# Altium schematic sheet PF5a_Filter1A.SchDoc
size A
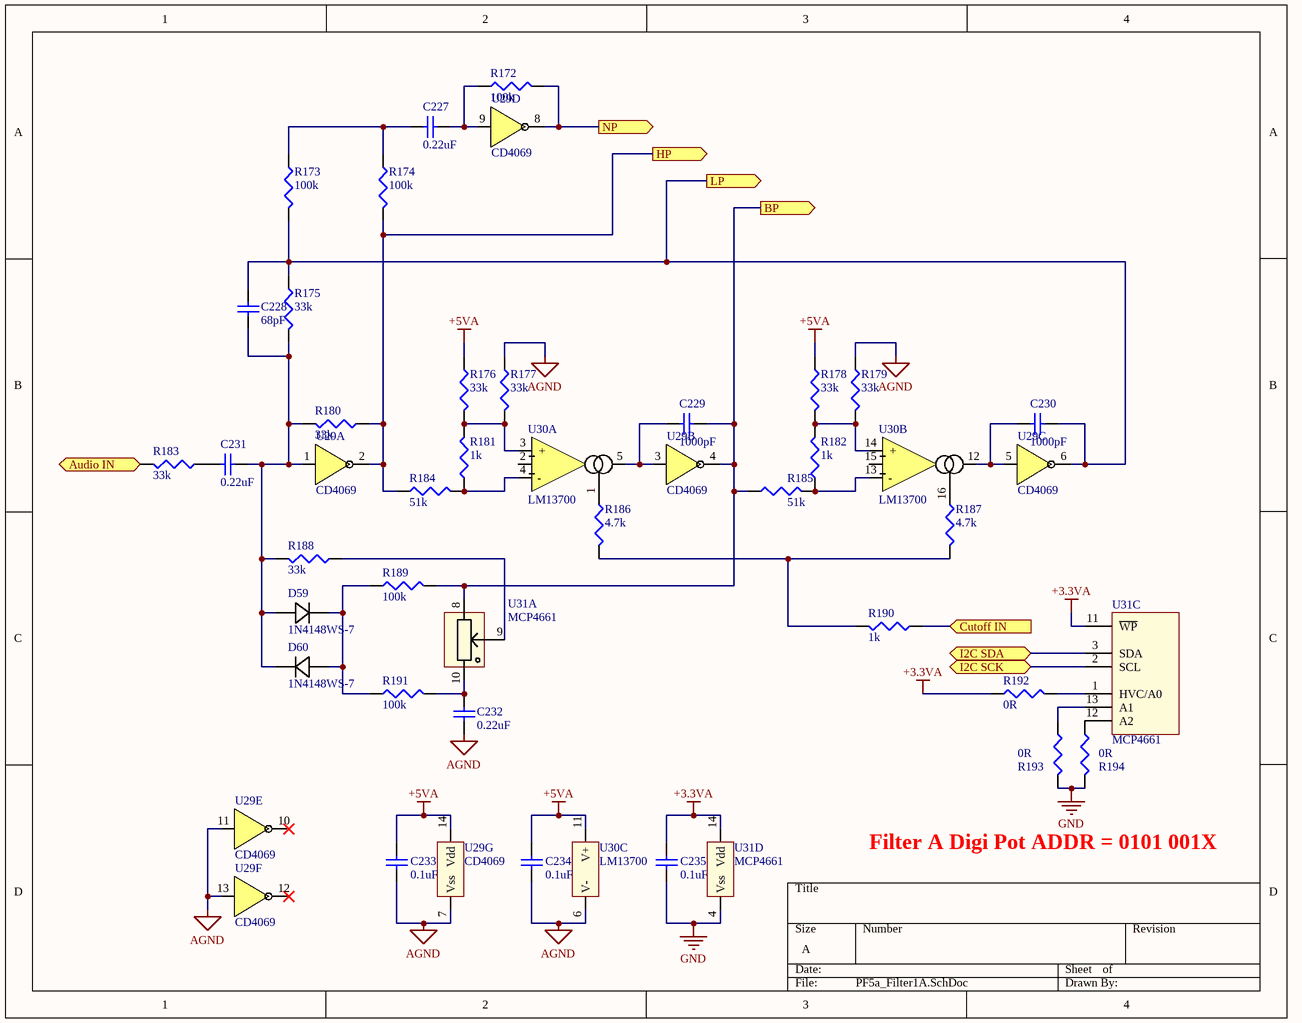
[diagram p0: PF5a_Filter1A.SchDoc]

## Parts
C227  0.22uF  [CAPC1608X08]
C228  68pF  [CAPC1608X08]
C229  1000pF  [CAPC1608X08]
C230  1000pF  [CAPC1608X08]
C231  0.22uF  [CAPC1608X08]
C232  0.22uF  [CAPC1608X08]
C233  0.1uF  [CAPC1608X08]
C234  0.1uF  [CAPC1608X08]
C235  0.1uF  [CAPC1608X08]
D59  1N4148WS-7  [SOD323-M]
D60  1N4148WS-7  [SOD323-M]
R172  100k  [RESC1608X05]
R173  100k  [RESC1608X05]
R174  100k  [RESC1608X05]
R175  33k  [RESC1608X05]
R176  33k  [RESC1608X05]
R177  33k  [RESC1608X05]
R178  33k  [RESC1608X05]
R179  33k  [RESC1608X05]
R180  33k  [RESC1608X05]
R181  1k  [RESC1608X05]
R182  1k  [RESC1608X05]
R183  33k  [RESC1608X05]
R184  51k  [RESC1608X05]
R185  51k  [RESC1608X05]
R186  4.7k  [RESC1608X05]
R187  4.7k  [RESC1608X05]
R188  33k  [RESC1608X05]
R189  100k  [RESC1608X05]
R190  1k  [RESC1608X05]
R191  100k  [RESC1608X05]
R192  0R  [RESC1608X05]
R193  0R  [RESC1608X05]
R194  0R  [RESC1608X05]
U29  CD4069  [D14-M]  (parts A,B,C,D,E,F,G of 7)
U30  LM13700  [SO16NB]  (parts A,B,C of 3)
U31  MCP4661  [TSSOP14_MC-M]  (parts A,C,D of 4)

## Ports
Audio IN (in), BP (out), Cutoff IN (in), HP (out), I2C SCK, I2C SDA, LP (out), NP (out)

## Nets
+3.3VA: C235.1 R192.1 U31.11(~{WP}) U31.14(Vdd)
+5VA: C233.1 C234.1 R176.1 R178.1 U29.14(Vdd) U30.11(V+)
AGND: C232.1 C233.2 C234.2 R177.1 R179.1 U29.7(Vss) U29.11(E) U29.13(F) U30.6(V-)
GND: C235.2 R193.2 R194.2 U31.4(Vss)
Audio IN: R183.2 ; port Audio IN
BP: C229.2 R185.1 R189.2 U29.4(~{B}) U31.8(P0A) ; port BP
Cutoff IN: R190.1 ; port Cutoff IN
HP: R174.2 R180.1 R184.1 U29.2(~{A}) ; port HP
I2C SCK: U31.2(SCL) ; port I2C SCK
I2C SDA: U31.3(SDA) ; port I2C SDA
LP: C228.2 C230.2 R173.2 R175.1 U29.6(~{C}) ; port LP
NP: R172.2 U29.8(~{D}) ; port NP
NetC227_1: C227.1 R173.1 R174.1
NetC227_2: C227.2 R172.1 U29.9(D)
NetC228_1: C228.1 C231.2 D59.2 D60.1 R175.2 R180.2 R188.2 U29.1(A)
NetC229_1: C229.1 U29.3(B) U30.5(OUT)
NetC230_1: C230.1 U29.5(C) U30.12(OUT)
NetC231_1: C231.1 R183.1
NetC232_2: C232.2 R191.2 U31.10(P0B)
NetD59_1: D59.1 D60.2 R189.1 R191.1
NetR176_2: R176.2 R177.2 R181.2 U30.3(+)
NetR178_2: R178.2 R179.2 R182.2 U30.14(+)
NetR181_1: R181.1 R184.2 U30.4(-)
NetR182_1: R182.1 R185.2 U30.13(-)
NetR186_1: R186.1 U30.1(BIAS)
NetR186_2: R186.2 R187.2 R190.2
NetR187_1: R187.1 U30.16(BIAS)
NetR188_1: R188.1 U31.9(P0W)
NetR192_2: R192.2 U31.1(HVC/A0)
NetR193_1: R193.1 U31.13(A1)
NetR194_1: R194.1 U31.12(A2)

Not connected (* = marked no-connect by the designer): U29 10(~{E})* 12(~{F})*; U30 2(Diode_BIAS) 15(Diode_BIAS)

## Notes on the sheet
- Filter A Digi Pot ADDR = 0101 001X

## Library data of the parts
C227 C231 C232 = Cap Semi: Capacitor (Semiconductor SIM Model); Fabricant: MURATA; Fournisseur: Farnell; RefFabricant: GRM188R71A224KA01D; RefFournisseur: 2695909; Value: 0.22uF; Case: 0603 [1608 Metric]; DataSheet: http://www.farnell.com/datasheets/2048635.pdf
C228 = Cap Semi: Capacitor (Semiconductor SIM Model); Fabricant: MURATA; Fournisseur: Farnell; RefFabricant: GRT1885C1H680JA02D; RefFournisseur: 2672146; Value: 68pF; Case: 0603 [1608 Metric]; DataSheet: http://www.farnell.com/datasheets/2165946.pdf
C229 C230 = Cap Semi: Capacitor (Semiconductor SIM Model); Fabricant: MURATA; Fournisseur: Farnell; RefFabricant: GRT1885C1H102JA02D; RefFournisseur: 2672134; Value: 1000pF; Case: 0603 [1608 Metric]; DataSheet: http://www.farnell.com/datasheets/2165937.pdf
C233-C235 = Cap Semi: Capacitor (Semiconductor SIM Model); Fabricant: MURATA; Fournisseur: Farnell; RefFabricant: GRM188F51E104ZA01D; RefFournisseur: 2821272; Value: 0.1uF; Case: 0603 [1608 Metric]; DataSheet: http://www.farnell.com/datasheets/2048672.pdf
D59 D60 = 1N4148WS-7: Diode signaux faibles; Fabricant: ON SEMICONDUCTOR; Fournisseur: Farnell; RefFournisseur: 2453269; DataSheet: http://www.farnell.com/datasheets/2288055.pdf; RefFabricant: 1N4148WS
R172-R174 R189 R191 = Res3: Resistor; Fabricant: TE CONNECTIVITY; Fournisseur: Farnell; RefFabricant: RN73C1J100KBTDF; RefFournisseur: 2687850; Value: 100k; Case: 0603 [1608 Metric]; DataSheet: http://www.farnell.com/datasheets/2189072.pdf
R175-R180 R183 R188 = Res3: Resistor; Fabricant: TE CONNECTIVITY; Fournisseur: Farnell; RefFabricant: CPF-A-0603B33KE1; RefFournisseur: 2483920; Value: 33k; Case: 0603 [1608 Metric]
R181 R182 R190 = Res3: Resistor; Fabricant: TE CONNECTIVITY; Fournisseur: Farnell; RefFabricant: CPF-A-0603B1K0E1; RefFournisseur: 2483880; Value: 1k; Case: 0603 [1608 Metric]; DataSheet: http://www.farnell.com/datasheets/1935020.pdf
R184 R185 = Res3: Resistor; Fabricant: TE CONNECTIVITY; Fournisseur: Farnell; RefFabricant: CPF0603B51KE1; RefFournisseur: 2331265; Value: 51k; Case: 0603 [1608 Metric]; DataSheet: http://www.farnell.com/datasheets/2043335.pdf
R186 R187 = Res3: Resistor; Fabricant: TE CONNECTIVITY; Fournisseur: Farnell; RefFabricant: CPF-A-0603B4K7E1; RefFournisseur: 2483933; Value: 4.7k; Case: 0603 [1608 Metric]; DataSheet: http://www.farnell.com/datasheets/1935020.pdf
R192-R194 = Res3: Resistor; Value: 0; Case: 0603 [1608 Metric]
U29 = CD4069: Hex Inverter; Fabricant: TEXAS INSTRUMENTS; Fournisseur: Farnell; RefFabricant: CD4069UBM; RefFournisseur: 1607751; DataSheet: http://www.ti.com/lit/ds/symlink/cd4069ub.pdf
U30 = LM13700M: Dual Transconductance OpAmp; Fabricant: TEXAS INSTRUMENTS; Fournisseur: Farnell; RefFabricant: LM13700M/NOPB; RefFournisseur: 1468910; DataSheet: http://www.ti.com/lit/ds/symlink/lm13700.pdf
U31 = MCP4661: Dual DigiPot non volatile I2C; RefFournisseur: 1840724; RefFabricant: MCP4661-503E/ST; Fournisseur: Farnell; Fabricant: MICROCHIP; DataSheet: http://www.farnell.com/datasheets/2243913.pdf